# Altium schematic sheet Ethernet.SchDoc
size A3
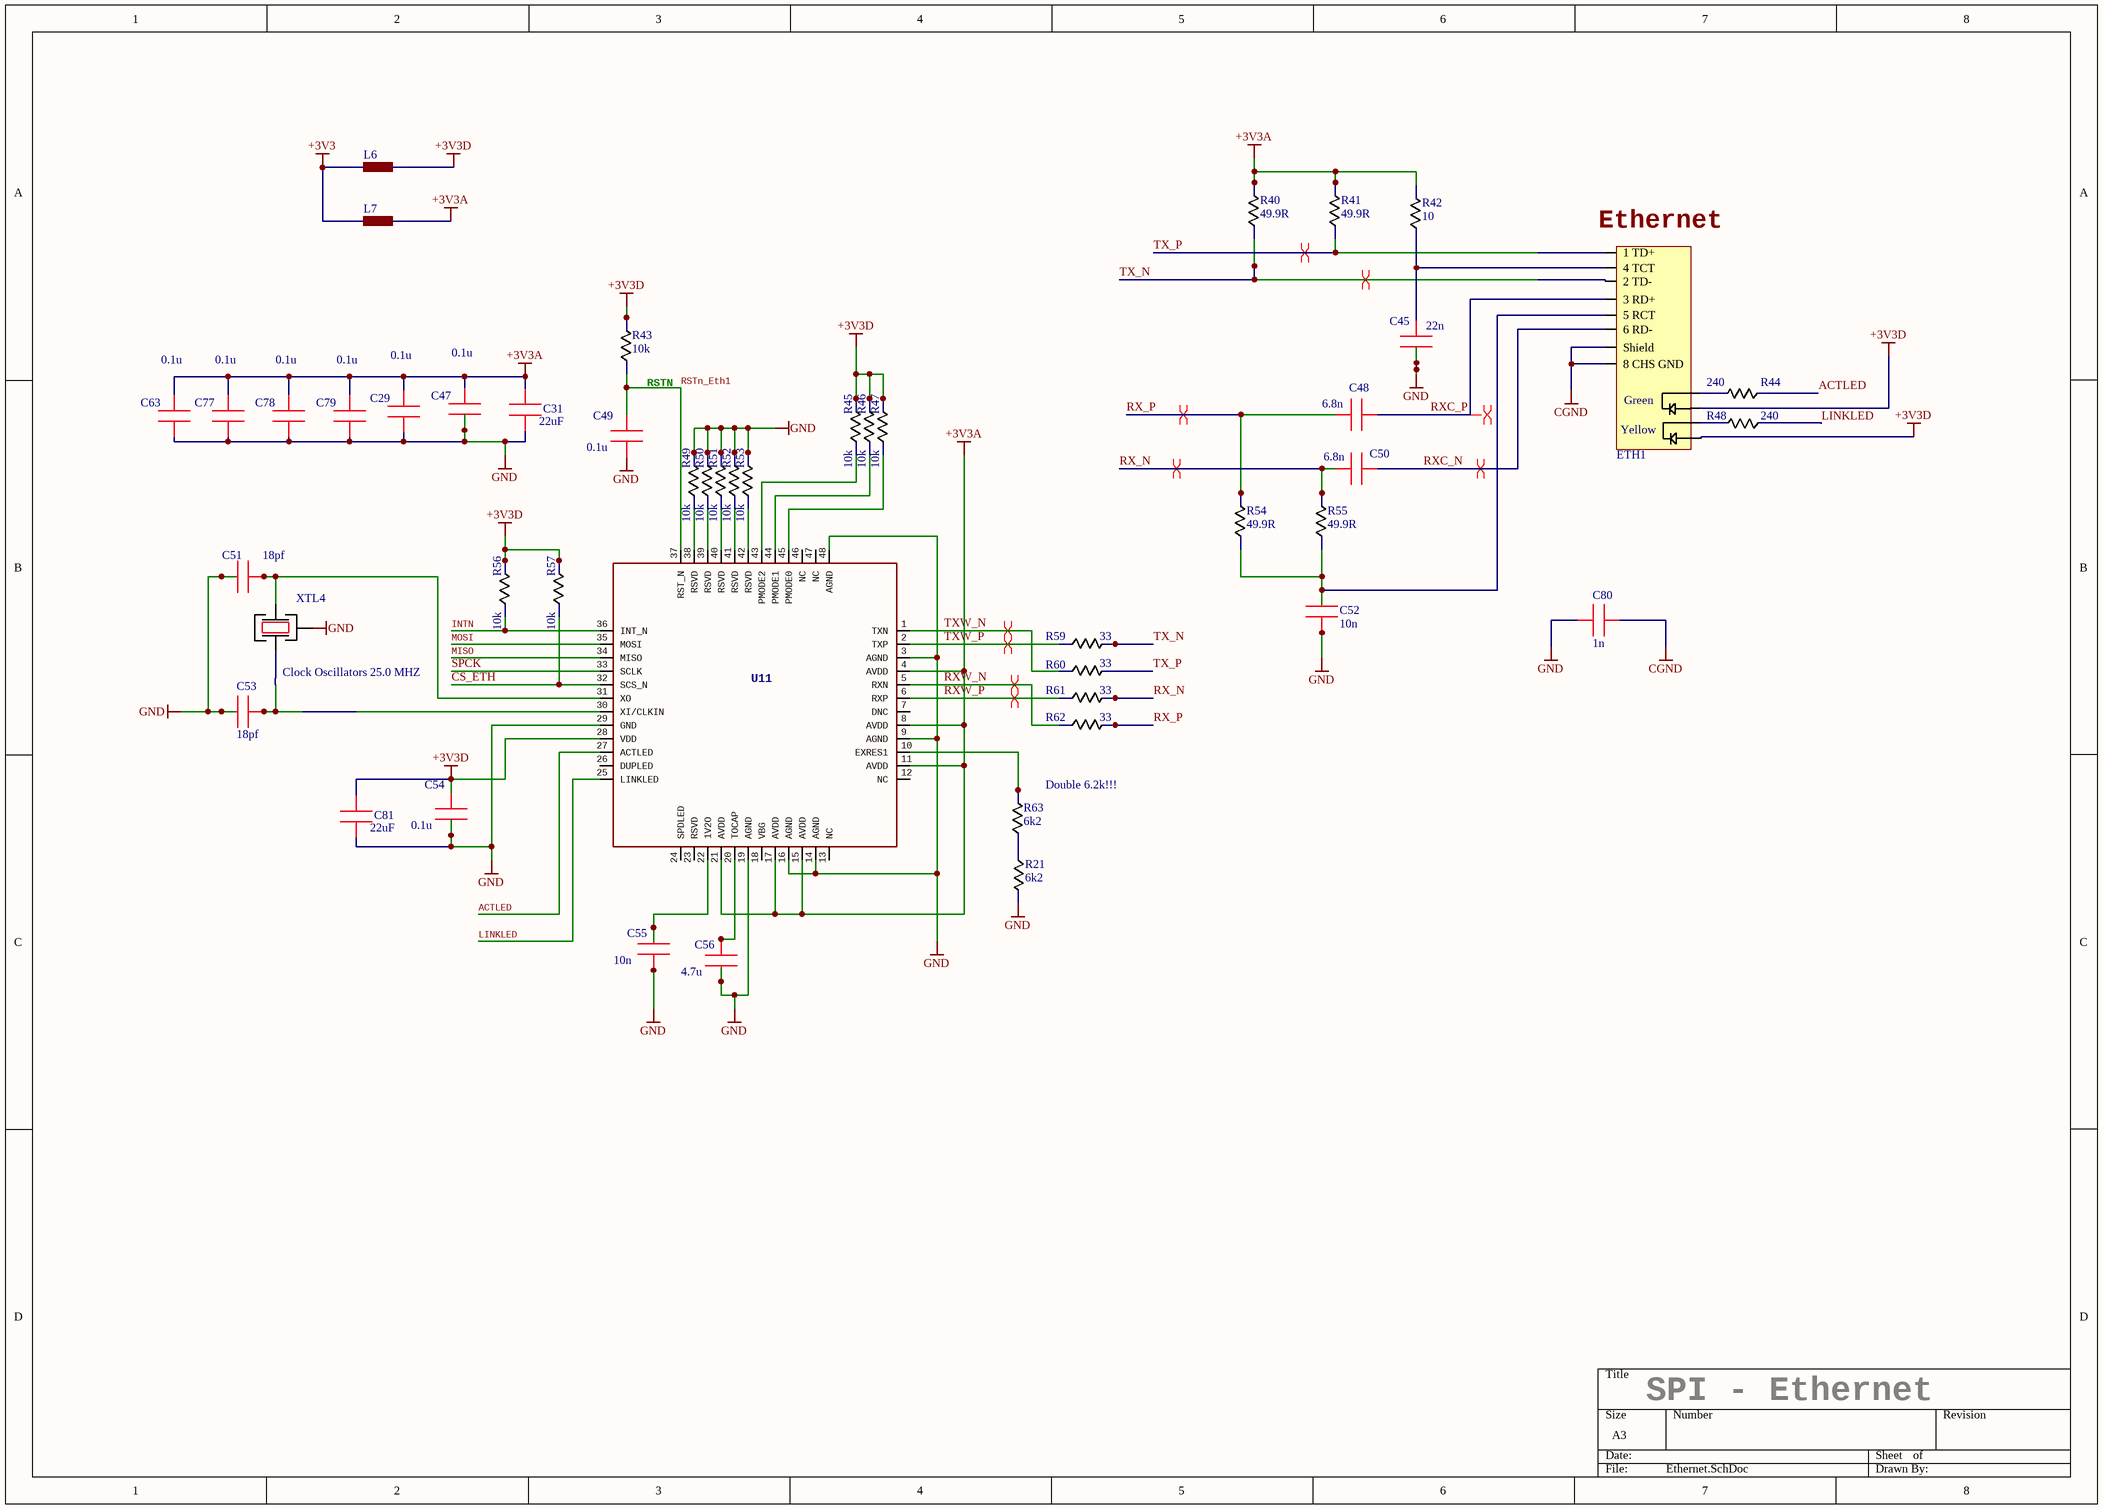
[diagram p0: Ethernet.SchDoc]

## Parts
C29  0.1u  [0603]
C31  22uF  [1206]
C45  22n  [0603]
C47  0.1u  [0603]
C48  6.8n  [0603]
C49  0.1u  [0603]
C50  6.8n  [0603]
C51  18pf  [0603]
C52  10n  [0603]
C53  18pf  [0603]
C54  0.1u  [0603]
C55  10n  [0603]
C56  4.7u  [0603]
C63  0.1u  [0603]
C77  0.1u  [0603]
C78  0.1u  [0603]
C79  0.1u  [0603]
C80  1n  [1206]
C81  22uF  [1206]
ETH1  (no value)  [RJ45]
L6  (no value)  [0805]
L7  (no value)  [0805]
R21  6k2  [0603]
R40  49.9R  [0603]
R41  49.9R  [0603]
R42  10  [0603]
R43  10k  [0603]
R44  240  [0603]
R45  10k  [0603]
R46  10k  [0603]
R47  10k  [0603]
R48  240  [0603]
R49  10k  [0603]
R50  10k  [0603]
R51  10k  [0603]
R52  10k  [0603]
R53  10k  [0603]
R54  49.9R  [0603]
R55  49.9R  [0603]
R56  10k  [0603]
R57  10k  [0603]
R59  33  [0603]
R60  33  [0603]
R61  33  [0603]
R62  33  [0603]
R63  6k2  [0603]
U11  (no value)  [LQFP 48]
XTL4  Part Description: Clock Oscillators 25.0 MHZ  [KX-7 XTAL]

## Nets
+3V3: L6.1 L7.1
+3V3A: C29.1 C31.2 C47.1 C63.1 C77.1 C78.1 C79.1 L7.2 R40.2 R41.2 R42.2 U11.4(AVDD) U11.8(AVDD) U11.11(AVDD) U11.15(AVDD) U11.17(AVDD) U11.21(AVDD)
+3V3D: C54.1 C81.2 ETH1.9(LDGr) ETH1.12(LDYE) L6.2 R43.2 R45.2 R46.2 R47.2 R56.2 R57.2 U11.28(VDD)
CGND: C80.2 ETH1.8(8_CHS_GND) ETH1.SHIELD(Shield)
GND: C29.2 C31.1 C45.2 C47.2 C49.2 C51.1 C52.2 C53.1 C54.2 C55.2 C56.2 C63.2 C77.2 C78.2 C79.2 C80.1 C81.1 R21.2 R49.2 R50.2 R51.2 R52.2 R53.2 U11.3(AGND) U11.9(AGND) U11.14(AGND) U11.16(AGND) U11.19(AGND) U11.29(GND) U11.48(AGND) XTL4.2
ACTLED: R44.1 U11.27(ACTLED)
CS_ETH: R57.1 U11.32(SCS_N)
INTN: R56.1 U11.36(INT_N)
LINKLED: R48.1 U11.25(LINKLED)
MISO: U11.34(MISO)
MOSI: U11.35(MOSI)
RSTn_Eth1: C49.1 R43.1 U11.37(RST_N)
RX_N: C50.1 R55.2 R61.2
RX_P: C48.1 R54.2 R62.2
RXC_N: C50.2 ETH1.6(6_RD-)
RXC_P: C48.2 ETH1.3(3_RD+)
RXW_N: R62.1 U11.5(RXN)
RXW_P: R61.1 U11.6(RXP)
SPCK: U11.33(SCLK)
TX_N: ETH1.2(2_TD-) R40.1 R59.2
TX_P: ETH1.1(1_TD+) R41.1 R60.2
TXW_N: R60.1 U11.1(TXN)
TXW_P: R59.1 U11.2(TXP)
NetC45_1: C45.1 ETH1.4(4_TCT) R42.1
NetC51_2: C51.2 U11.31(XO) XTL4.3
NetC52_1: C52.1 ETH1.5(5_RCT) R54.1 R55.1
NetC53_2: C53.2 U11.30(XI/CLKIN) XTL4.1
NetC55_1: C55.1 U11.22(1V2O)
NetC56_1: C56.1 U11.20(TOCAP)
NetETH1_10: ETH1.10(LDGr) R44.2
NetETH1_11: ETH1.11(LDYE) R48.2
NetR21_1: R21.1 R63.1
NetR45_1: R45.1 U11.43(PMODE2)
NetR46_1: R46.1 U11.44(PMODE1)
NetR47_1: R47.1 U11.45(PMODE0)
NetR49_1: R49.1 U11.38(RSVD)
NetR50_1: R50.1 U11.39(RSVD)
NetR51_1: R51.1 U11.40(RSVD)
NetR52_1: R52.1 U11.41(RSVD)
NetR53_1: R53.1 U11.42(RSVD)
NetR63_2: R63.2 U11.10(EXRES1)

Not connected (* = marked no-connect by the designer): U11 7(DNC) 12(NC) 13(NC) 18(VBG) 23(RSVD) 24(SPDLED) 26(DUPLED) 46(NC) 47(NC)

## Layout directives
differential pair: RX_N, RX_P, RXC_N, RXC_P, RXW_N, RXW_P, TX_N, TX_P, TXW_N, TXW_P

## Notes on the sheet
- (near ETH1) Ethernet
- (near R43) RSTN
- (near R63) Double 6.2k!!!
- SPI - Ethernet
- (in symbol J0011D21BNL) Green; Yellow

## Library data of the parts
C29 C47 C49 C54 C63 C77-C79 = 0603 CAP: Part Description: 0.1 uF 100 VDC 10% 0603 X7R; Part Number: GRM188R72A104KA35D
C31 C81 = 0805 Cap: Part Description: 16V 22uF X5R 1206 10%; Part Number: CC1206KKX5R7BB226
C45 = 0603 CAP: Part Description: 0.022UF 50V 10% 0603; Part Number: GRM188R71H223KA01D
C48 C50 = 0603 CAP: Part Description: 50V 6800pF X7R 0603 10%; Part Number: CC0603KRX7R9BB682
C51 C53 = 0603 CAP: Part Description: 18 pF 50 VDC 5% 0603 C0G; Part Number: GRM1885C1H180JA01D
C52 C55 = 0603 CAP: Part Description: 50V 0.01uF X7R 0603 5%; Part Number: CC0603JRX7R9BB103
C56 = 0603 CAP: Part Description: 16V 4.7uF X5R 0603 10%; Part Number: CC0603KRX5R7BB475
C80 = 0603 CAP: Part Description: 2kV 1000pF X7R 1206 10%; Part Number: CC1206KKX7RDBB102
ETH1 = J0011D21BNL: Part Description: RJ45 MagJack; Part Number: J0011D21BNL
L6 L7 = BLM21PG220SN1D: Part Description: Ferrite Beads 1000 OHM 25%  100 MHz; Part Number: BLM41PG102SN1L
R21 = Resistor 0805: Part Description: Resistor 0603, 6.2kOhms, 5%, 1/10W; Part Number: RC0603JR-076K2L
R40 R41 R54 R55 = 0603 RES: Part Description: Resistor 0603, 49.9Ohms, 1%, 1/10W; Part Number: RC0603FR-0749R9
R42 = 0603 RES: Part Description: Resistors - 1/8 Watt 10ohms 1%; Part Number: CRCW060310R0FKEA
R43 R45-R47 R49-R53 R56 R57 = 0603 RES: Part Description: Resistor 0603, 10kOhms, 5%, 1/10W; Part Number: RC0603JR-0710K
R44 R48 = 0603 RES: Part Description: Resistor 0603, 240Ohms, 1%, 1/10W; Part Number: RC0603FR-07240RL
R59-R62 = 0603 RES: Part Description: Resistor 0603, 33Ohms, 1%, 1/10W; Part Number: RC0603FR-0733RL
R63 = 0603 RES: Part Description: Resistor 0603, 6.2kOhms, 5%, 1/10W; Part Number: RC0603JR-076K2L
U11 = W5500: Part Description: Ethernet ICs 3in1 Enet Controller TCP/IP +MAC+PHY; Part Number: W5500
XTL4 = KX-7: Part Number: Geyer KX-7 25.0 MHz